# EAGLE design encoder (EAGLE 9.6.2)
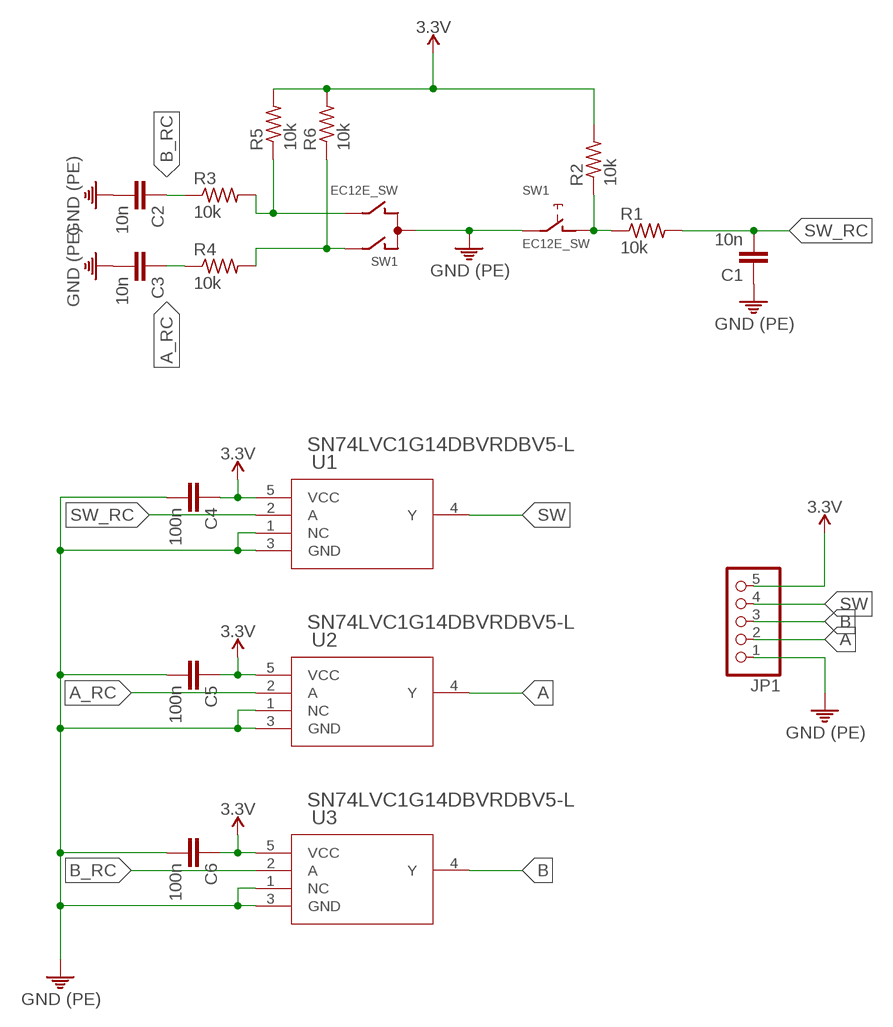
[diagram p0: schematic, sheet 1]

## Parts
C1  10n  C-EUC0603  [C0603]
C2  10n  C-EUC0603  [C0603]
C3  10n  C-EUC0603  [C0603]
C4  100n  C-EUC0603  [C0603]
C5  100n  C-EUC0603  [C0603]
C6  100n  C-EUC0603  [C0603]
JP1  PINHD-1X5  [1X05]
R1  10k  R-US_R0603  [R0603]
R2  10k  R-US_R0603  [R0603]
R3  10k  R-US_R0603  [R0603]
R4  10k  R-US_R0603  [R0603]
R5  10k  R-US_R0603  [R0603]
R6  10k  R-US_R0603  [R0603]
SW1  EC12E_SW  [ALPS_EC12E_SW]
U1  SN74LVC1G14DBVRDBV5-L  [DBV5-L]
U2  SN74LVC1G14DBVRDBV5-L  [DBV5-L]
U3  SN74LVC1G14DBVRDBV5-L  [DBV5-L]

## Nets
3.3V: C4.1 C5.1 C6.1 JP1.5 R2.2 R5.2 R6.2 U1.5(VCC) U2.5(VCC) U3.5(VCC)
A: JP1.2 U2.4(Y)
A_RC: C3.1 R4.1 U2.2(A)
B: JP1.3 U3.4(Y)
B_RC: C2.1 R3.1 U3.2(A)
N$1: R1.1 R2.1 SW1.D
N$3: R3.2 R5.1 SW1.B
N$4: R4.2 R6.1 SW1.A
PE: C1.1 C2.2 C3.2 C4.2 C5.2 C6.2 JP1.1 SW1.C SW1.E U1.1(NC) U1.3(GND) U2.1(NC) U2.3(GND) U3.1(NC) U3.3(GND) ; supply symbol labelled POWER-GND
SW: JP1.4 U1.4(Y)
SW_RC: C1.2 R1.2 U1.2(A)
Unconnected: SW1.GND1(G) SW1.GND2(G)

## Library data of the parts
C1-C6 = rcl:C-EU: CAPACITOR, European symbol; SPICEPREFIX: C
JP1 = pinhead:PINHD-1X5: PIN HEADER
R1-R6 = rcl:R-US_: RESISTOR, American symbol; SPICEPREFIX: R
SW1 = switch-alps:EC12E_SW: ALPS rotary Encoder EC12E series with switch; MPN: EC12E2424407; OC_FARNELL: 1520813; OC_NEWARK: 74M1068
U1-U3 = 0000-master:SN74LVC1G14DBVR; COPYRIGHT: Copyright (C) 2022 Ultra Librarian. All rights reserved.; MANUFACTURER_PART_NUMBER: SN74LVC1G14DBVR; MFR_NAME: Texas Instruments

## Board
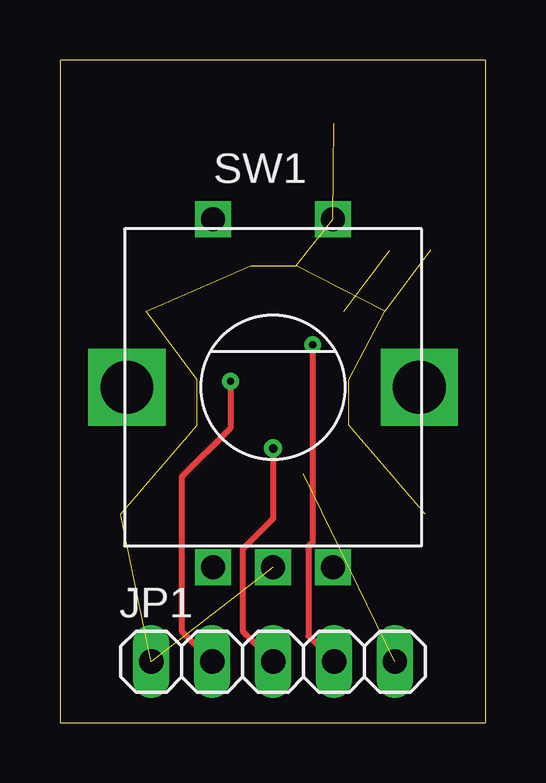
[diagram p1: board, top side]
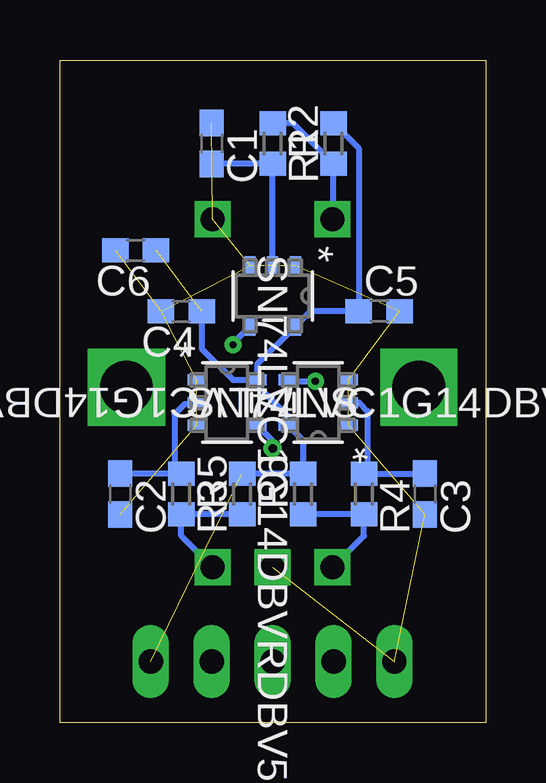
[diagram p2: board, bottom side, seen from below]

Size 17.76 x 27.61 mm. Coordinates in mm from the lower left corner, seen from the top.
Outline: 0,0 17.76,0 17.76,27.61 0,27.61 0,0
Copper layers (1*16): Top 0.035mm / dielectric 1.5mm / Bottom 0.035mm
Design rules "default": minimum track width 6mil, minimum drill 0.35mm, track to track 6mil, track to pad 6mil, pad to pad 6mil, via to via 6mil, smd to smd 6mil, copper to edge 40mil, drill to drill 6mil, minimum pad ring 10mil, minimum via ring 8mil, stop-mask expansion 4mil, vias tented up to drill 0mil, thermal gap 10mil

### Footprints (pad centres in the part's own frame; a part is rotated, then mirrored left to right if it is on the bottom)
C0603 = smd 1.1 x 1: 1 -0.85,0; 2 0.85,0
1X05 = drill 1.016 long: 1 -5.08,0; 2 -2.54,0; 3 0,0; 4 2.54,0; 5 5.08,0
R0603 = smd 1 x 1.1: 1 -0.85,0; 2 0.85,0
ALPS_EC12E_SW = drill 1 square: A -2.5,-7.5; B 2.5,-7.5; C 0,-7.5; D -2.5,7; E 2.5,7 | drill 2.2 square: GND1 -6.1,0; GND2 6.1,0
DBV5-L = smd 0.775 x 0.457: 1 -1.264,0.95; 2 -1.264,0; 3 -1.264,-0.95; 4 1.264,-0.95; 5 1.264,0.95

### Placement (x,y rotation side)
C1  11.43,24.13 270 bottom
C2  15.24,9.53 270 bottom
C3  2.54,9.53 270 bottom
C4  12.7,17.14 180 bottom
C5  4.45,17.14 0 bottom
C6  14.61,19.68 180 bottom
JP1  8.89,2.54 0 top
R1  8.89,24.13 270 bottom
R2  6.35,24.13 90 bottom
R3  12.7,9.53 270 bottom
R4  5.08,9.53 270 bottom
R5  10.16,9.53 90 bottom
R6  7.62,9.53 90 bottom
SW1  8.89,13.97 0 top
U1  8.89,17.78 270 bottom
U2  6.99,13.34 180 bottom
U3  10.79,13.34 0 bottom

### Tracks (layer width: path | path; a pad name or v marks a point on that pad's centre or on a via)
3.3V  (2 unrouted)
  Bottom 0.254: U3.5 9.53,14.05 8.25,12.77 U2.5 7.62,11.76 R6.2 R5.2 | U3.5 9.53,14.93 U1.5 7.31,17.14 C5.1 5.29,23.93 R2.2 | C4.1 11.85,15.59 10.55,14.29 U3.5
A  (via drill 0.3)
  Top 0.254: v7.11,14.22 7.11,12.27 5.08,10.24 5.08,3.81 JP1.2
  Bottom 0.254: U2.4 8.19,14.22 v7.11,14.22
A_RC
  Bottom 0.254: U2.2 5.28,13.34 4.93,12.98 4.93,10.53 R4.1 C3.1
B  (via drill 0.35)
  Top 0.254: v8.89,11.43 8.89,8.5 7.62,7.23 7.62,3.81 JP1.3
  Bottom 0.254: U3.4 8.89,11.74 v8.89,11.43
B_RC
  Bottom 0.254: U3.2 12.12,13.27 12.56,13.27 12.98,12.86 12.98,10.65 R3.1 C2.1
N$1
  Bottom 0.254: SW1.D 6.35,21.01 R2.1 8.05,24.98 R1.1
N$3
  Bottom 0.254: SW1.B 12.7,7.78 12.7,8.26 | 12.7,8.26 R3.2 | R5.1 12.28,8.68 12.7,8.26
N$4
  Bottom 0.254: SW1.A 5.08,7.78 R4.2 R6.1
PE  (14 unrouted)
SW  (via drill 0.3)
  Top 0.254: v10.54,15.75 10.54,7.52 10.36,7.34 10.36,3.61 JP1.4
  Bottom 0.254: U1.4 10.54,15.81 v10.54,15.75
SW_RC
  Bottom 0.254: C1.2 R1.2 U1.2